# Altium schematic sheet CallerID.SchDoc: Caller ID
size A4; Organization: ORGANIZATION; Address1: ADDRESS 1; Address2: ADDRESS 2; Address3: ADDRESS 3; Address4: ADDRESS 4; Revision: -; SheetNumber: 7; SheetTotal: 11; ENG_APP_DATE: --/--/--; DSN_APP_DATE: --/--/--; CHK_APP_DATE: --/--/--
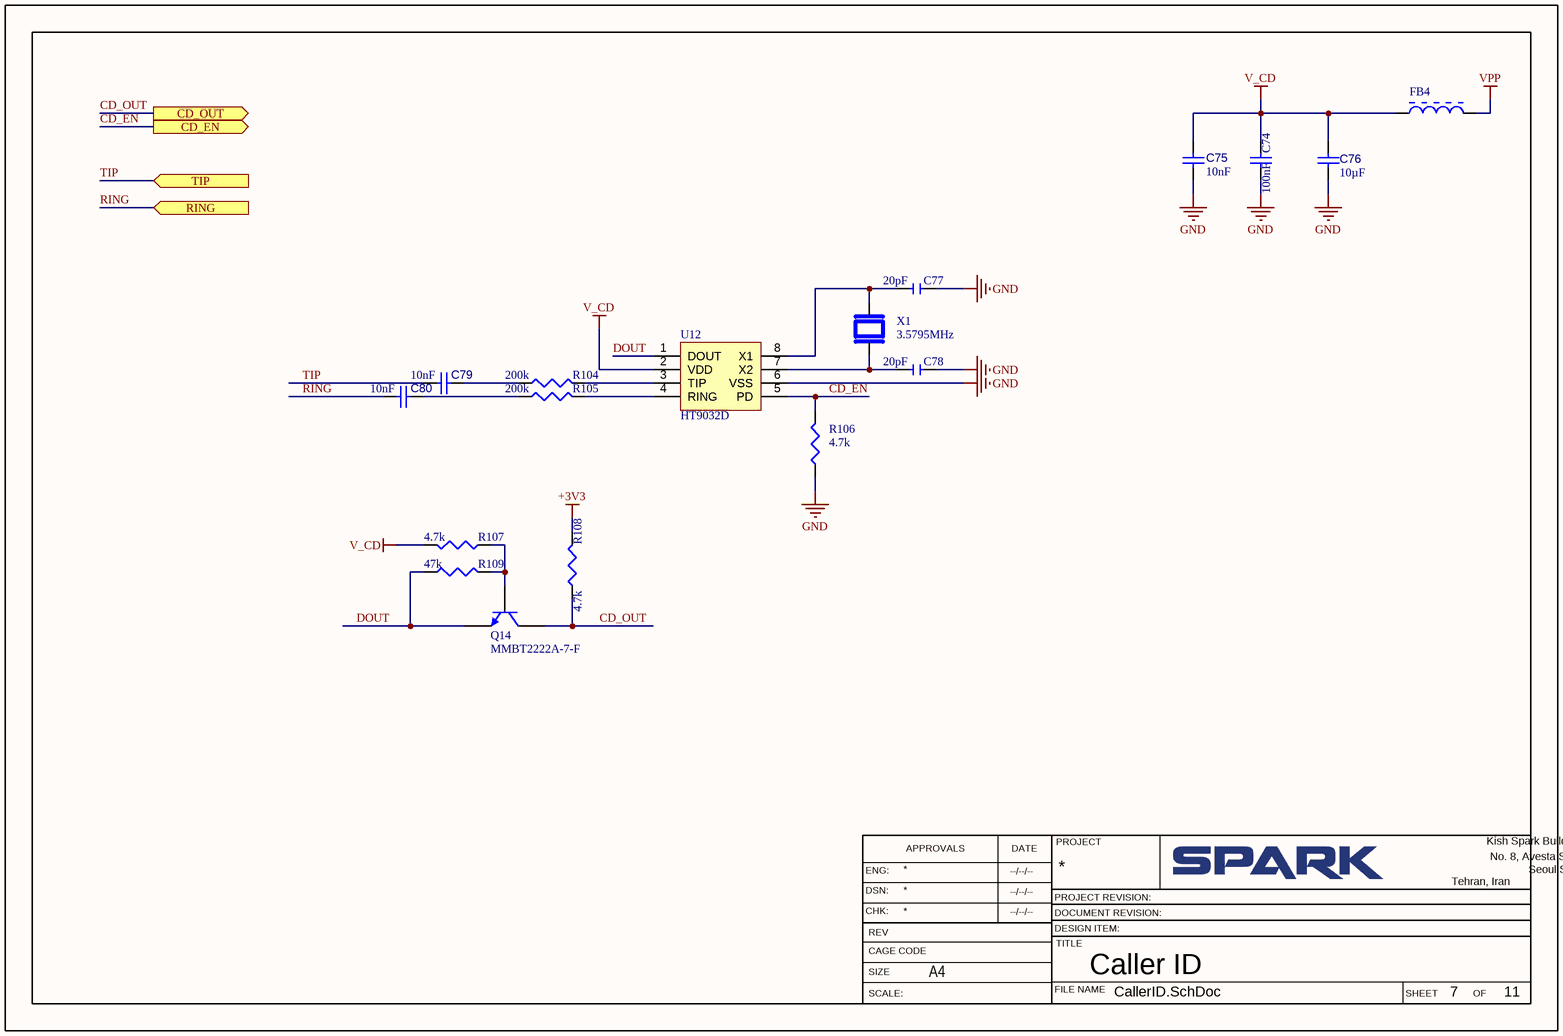
[diagram p0: CallerID.SchDoc]

## Parts
C74  value 100nF  [C0603]  (hidden comment: CC0603KRX7R8BB104)
C75  value 10nF  [C0603]  (hidden comment: 06035C103KAT2A)
C76  value 10µF  [0805]  (hidden comment: C0805C106K9PACTU)
C77  value 20pF  [0805]  (hidden comment: CMP-001-00183-1)
C78  value 20pF  [0805]  (hidden comment: CMP-001-00183-1)
C79  value 10nF  [C0603]  (hidden comment: 06035C103KAT2A)
C80  value 10nF  [C0603]  (hidden comment: 06035C103KAT2A)
FB4  CMP-006-00051-1  [R0603]  (value not drawn)
Q14  MMBT2222A-7-F  [SOT23127P600-8N]
R104  value 200k  [0805]  (hidden comment: CMP-009-00307-1)
R105  value 200k  [0805]  (hidden comment: CMP-009-00307-1)
R106  value 4.7k  [R0603]  (hidden comment: KTR03EZPJ472)
R107  value 4.7k  [R0603]  (hidden comment: KTR03EZPJ472)
R108  value 4.7k  [R0603]  (hidden comment: KTR03EZPJ472)
R109  value 47k  [0805]  (hidden comment: CMP-009-00314-1)
U12  HT9032D  [SSOIC8]
X1  Frequency: 3.5795MHz  [XTAL]  (hidden comment: CMP-003-00038-1)

## Ports
CD_EN (out), CD_OUT (out), RING (in), TIP (in)

## Nets
+3V3: R108.2
GND: C74.2 C75.2 C76.1 C77.1 C78.1 R106.1 U12.6(VSS)
V_CD: C74.1 C75.1 C76.2 FB4.1 R107.2 U12.2(VDD)
VPP: FB4.2
CD_EN: R106.2 U12.5(PD) ; port CD_EN
CD_OUT: Q14.3(C) R108.1 ; port CD_OUT
DOUT: Q14.1(E) R109.1 U12.1(DOUT)
RING: C80.2 ; port RING
TIP: C79.2 ; port TIP
NetC77_2: C77.2 U12.8(X1) X1.1
NetC78_2: C78.2 U12.7(X2) X1.2
NetC79_1: C79.1 R104.1
NetC80_1: C80.1 R105.1
NetQ14_2: Q14.2(B) R107.1 R109.2
NetR104_2: R104.2 U12.3(TIP)
NetR105_2: R105.2 U12.4(RING)

## Notes on the sheet
- APPROVALS
- DATE
- PROJECT
- Kish Spark Building
- No. 8, Avesta Street
- ENG:
- DSN:
- CHK:
- PROJECT REVISION:
- DESIGN ITEM:
- DOCUMENT REVISION:
- Tehran, Iran
- Seoul Street, Sheikh Bahaie
- SIZE
- REV
- SCALE:
- CAGE CODE
- A4
- FILE NAME
- TITLE
- SHEET
- OF

## Library data of the parts
C74 = CMP-001-00108-2: YAGEO - CC0603KRX7R8BB104 - CERAMIC CAPACITOR, 0.1UF, 25V, X7R, 10%, 0603, FULL REEL; Case/Package: 0603; Pins: 2; RoHS Compliant: Yes; Min Operating Temperature: -55°C; Max Operating Temperature: 125°C; Voltage Rating: 25V; Tolerance: 10%; Design Item ID: CC0603KRX7R8BB104; Case Code (Metric): 1608; Category: Ceramic Capacitors; Depth: 0.8mm; Dielectric: X7R; Halogen Free: Halogen Free; Height: 0.8mm; Lead Free: Lead Free; Length: 1.6mm; Manufacturer 1: Yageo; Manufacturer Part Number 1: CC0603KRX7R8BB104; Mount: Surface Mount; Package Quantity: 1; Packaging: Tape and Reel; Pricing 1: 1=0.10000, 10=0.05000, 50=0.02720, 100=0.02220, 500=0.01586, 1000=0.01246 (USD); Radiation Hardening: No; REACH SVHC: Unknown; Resistor Type: Ceramic; RoHS: Yes; Series: CC; Source: PTZLib.SchLib; Stock 1: 4053185; Termination: SMD/SMT; Thickness: 0.035inch; Voltage: 25V; Voltage Rating (DC): 25V; Width: 0.8mm; ComponentLink1Description: https://datasheet.ciiva.com/144/mlccorderingcode-144075.pdf?src-supplier=Digi-Key; ComponentLink1URL: https://datasheet.ciiva.com/144/mlccorderingcode-144075.pdf?src-supplier=Digi-Key; ComponentLink2Description: https://datasheet.ciiva.com/11786/0900766b80c10176-11786120.pdf?src-supplier=RSComponents; ComponentLink2URL: https://datasheet.ciiva.com/11786/0900766b80c10176-11786120.pdf?src-supplier=RSComponents; ComponentLink3Description: https://datasheet.ciiva.com/7978/1489800-7978155.pdf?src-supplier=Element14; ComponentLink3URL: https://datasheet.ciiva.com/7978/1489800-7978155.pdf?src-supplier=Element14; ComponentLink4Description: https://datasheet.ciiva.com/28450/1489800-28450584.pdf?src-supplier=Element14; ComponentLink4URL: https://datasheet.ciiva.com/28450/1489800-28450584.pdf?src-supplier=Element14; ComponentLink5Description: https://datasheet.ciiva.com/144/mlccorderingcode-144074.pdf?src-supplier=Digi-Key; ComponentLink5URL: https://datasheet.ciiva.com/144/mlccorderingcode-144074.pdf?src-supplier=Digi-Key; ComponentLink6Description: https://datasheet.ciiva.com/144/mlccorderingcode-144073.pdf?src-supplier=Digi-Key; ComponentLink6URL: https://datasheet.ciiva.com/144/mlccorderingcode-144073.pdf?src-supplier=Digi-Key; ComponentLink7Description: https://datasheet.ciiva.com/13389/upy-gphc-x7r-6-3v-to-50v-8-13389352.pdf?src-supplier=Mouser; ComponentLink7URL: https://datasheet.ciiva.com/13389/upy-gphc-x7r-6-3v-to-50v-8-13389352.pdf?src-supplier=Mouser; ComponentLink8Description: https://datasheet.ciiva.com/11587/upy-gphc-x7r-6-3v-to-50v-8-11587208.pdf?src-supplier=Avnet; ComponentLink8URL: https://datasheet.ciiva.com/11587/upy-gphc-x7r-6-3v-to-50v-8-11587208.pdf?src-supplier=Avnet; ComponentLink9Description: https://datasheet.ciiva.com/26829/getdatasheetpartid-403577-26829431.pdf?src-supplier=Verical; ComponentLink9URL: https://datasheet.ciiva.com/26829/getdatasheetpartid-403577-26829431.pdf?src-supplier=Verical; ComponentLink10Description: https://datasheet.ciiva.com/17434/upy-gphc-x7r-6-3v-to-50v-8-17434263.pdf?src-supplier=Avnet+Europe; ComponentLink10URL: https://datasheet.ciiva.com/17434/upy-gphc-x7r-6-3v-to-50v-8-17434263.pdf?src-supplier=Avnet+Europe
C75 C79 C80 = CMP-001-00096-2: 0603 10nF 50 V ±10 % Tolerance X7R Surface Mount Multilayer Ceramic Capacitor; Manufacturer: Kyocera AVX; Voltage Rating: 50V; Tolerance: 10%; Dissipation Factor: 2.5%; Insulation Resistance: 100GR; Case/Package: 0603; Pins: 2; Min Operating Temperature: -55°C; Max Operating Temperature: 125°C; Design Item ID: 06035C103KAT2A; Case Code (Metric): 1608; Category: Ceramic Capacitors; Contact Plating: Tin,Matte; Depth: 0.81mm; Dielectric: X7R; Dielectric Material: Ceramic; Height: 0.9mm; Lead Free: Lead Free; Length: 1.6mm; Manufacturer Part Number: 06035C103KAT2A; Mount: Surface Mount,PCB; Packaging: Tape and Reel; Radiation Hardening: No; REACH SVHC: No SVHC; RoHS: Yes; Stock 1: 4334081; Termination: SMD/SMT; Thickness: 0.035inch; Voltage: 50V; Voltage Rating (DC): 50V; Width: 0.032inch; ComponentLink1Description: https://datasheet.ciiva.com/2987/cx7r-2987824.pdf?src-supplier=Avnet; ComponentLink1URL: https://datasheet.ciiva.com/2987/cx7r-2987824.pdf?src-supplier=Avnet; ComponentLink2Description: https://datasheet.ciiva.com/1124/1679506-1124848.pdf?src-supplier=Element14; ComponentLink2URL: https://datasheet.ciiva.com/1124/1679506-1124848.pdf?src-supplier=Element14; ComponentLink3Description: https://datasheet.ciiva.com/7855/1679506-7855082.pdf?src-supplier=Element14; ComponentLink3URL: https://datasheet.ciiva.com/7855/1679506-7855082.pdf?src-supplier=Element14; ComponentLink4Description: https://datasheet.ciiva.com/150/cx7r-150227.pdf?src-supplier=Digi-Key; ComponentLink4URL: https://datasheet.ciiva.com/150/cx7r-150227.pdf?src-supplier=Digi-Key; ComponentLink5Description: https://datasheet.ciiva.com/150/cx7r-150229.pdf?src-supplier=Digi-Key; ComponentLink5URL: https://datasheet.ciiva.com/150/cx7r-150229.pdf?src-supplier=Digi-Key
C76 = CMP-001-00180-2: Ceramic Capacitor, 10UF, 6.3V, X5R, 10%, 0805, Full Reel; Manufacturer: KEMET; Dissipation Factor: 5%; Capacitor Type: Ceramic Capacitors; Manufacturer Part Number: C0805C106K9PACTU; Mount: Surface Mount; Case/Package: 0805; Case Code (Metric): 2012; Dielectric Material: Ceramic; Contact Material: Tin; Min Operating Temperature: -55°C; Max Operating Temperature: 85°C; Tolerance: 10%; Voltage Rating (DC): 6.3V; Dielectric: X5R; Packaging: Tape and Reel; Voltage Rating: 6.3V; Series: SMD Comm X5R; Construction: Flat; Length: 2mm; Width: 1.2mm; Height: 1.25mm; Depth: 1.25mm; Lead Pitch: 0.75mm; Radiation Hardening: No; RoHS Compliant: Yes; Lead Free: Lead Free; Reach SVHC Compliant: No; ComponentLink1URL: https://datasheet.ciiva.com/7842/kem-c1006-x5r-smd-7842200.pdf?src-supplier=Element14; ComponentLink1Description: https://datasheet.ciiva.com/7842/kem-c1006-x5r-smd-7842200.pdf?src-supplier=Element14; ComponentLink2URL: https://datasheet.ciiva.com/7842/kem-c1006-x5r-smd-7842201.pdf?src-supplier=Element14; ComponentLink2Description: https://datasheet.ciiva.com/7842/kem-c1006-x5r-smd-7842201.pdf?src-supplier=Element14; ComponentLink3URL: https://datasheet.ciiva.com/7842/40889-7842553.pdf?src-supplier=Element14; ComponentLink3Description: https://datasheet.ciiva.com/7842/40889-7842553.pdf?src-supplier=Element14; ComponentLink4URL: https://datasheet.ciiva.com/7842/40889-7842554.pdf?src-supplier=Element14; ComponentLink4Description: https://datasheet.ciiva.com/7842/40889-7842554.pdf?src-supplier=Element14; ComponentLink5URL: https://datasheet.ciiva.com/18193/getdatasheetpartid-320652-18193500.pdf?src-supplier=Verical; ComponentLink5Description: https://datasheet.ciiva.com/18193/getdatasheetpartid-320652-18193500.pdf?src-supplier=Verical; Pins: 2; Mounting Technology: SMD/SMT
C77 C78 = CMP-001-00183-1: CAP CER 20PF 50V NPO 0805; Manufacturer: Yageo; Tolerance: 5%; Dielectric: NP0; Manufacturer Part Number: CC0805JRNPO9BN200; RoHS: Yes; Category: Ceramic Capacitors; Stock: 3029; Pricing: 1=0.13, 10=0.054, 50=0.054, 100=0.032, 1000=0.026, 10000=0.017 (USD); Mounting Technology: Surface Mount; Case/Package: 0805; Pins: 2; Case Code (Metric): 2012; Min Operating Temperature: -55°C; Max Operating Temperature: 125°C; Voltage Rating: 50V; Packaging: Tape and Reel; Voltage Rating (DC): 50V; Termination: SMD/SMT; Series: CC; Length: 0.079inch; Width: 1.25mm; Thickness: 0.028inch; Lead Free: Lead Free; ComponentLink1URL: https://datasheet.ciiva.com/5427/upy-gp-np0-16v-to-50v-8-5427416.pdf?src-supplier=Mouser; ComponentLink1Description: https://datasheet.ciiva.com/5427/upy-gp-np0-16v-to-50v-8-5427416.pdf?src-supplier=Mouser; Design Item ID: CC0805JRNPO9BN200; Component Type: Standard; Pin Count: 2; Source: V4-TEL.SCHLIB
FB4 = CMP-006-00051-1: Ferrite Beads 0603 60ohm; Manufacturer 1: Murata; Manufacturer Part Number 1: BLM18PG471SN1B; Tolerance: 25%; Impedance: 470R; DC Resistance (DCR): 200mR; Current Rating: 1A; RoHS: Yes; Category: Ferrite Beads and Chips; Case/Package: 0603; Min Operating Temperature: -55°C; Max Operating Temperature: 125°C; Package Quantity: 1000; Packaging: Bulk; ComponentLink1URL: http://www.mouser.com/ds/2/281/c31e-794748.pdf?src-supplier=Mouser; ComponentLink1Description: http://www.mouser.com/ds/2/281/c31e-794748.pdf?src-supplier=Mouser; Pins: 2; Design Item ID: BLM18PG471SN1B; Source: PTZLib.SchLib
Q14 = CMP-012-00003-2: MMBT2222 Series NPN 350 mW 40 V 600 mA SMT Small Signal Transistor - SOT-23; Manufacturer: Diodes; Current Rating: 600mA; Voltage Rating: 40V; Collector Base Voltage (VCBO): 75V; Collector Emitter Saturation Voltage: 1V; Current: 1A; Element Configuration: Single; Emitter Base Voltage (VEBO): 6V; Frequency: 300MHz; hFE Min: 100; Max Power Dissipation: 300mW; Number of Elements: 1; Power Dissipation: 350mW; Case/Package: SOT-23-3; Pins: 3; RoHS Compliant: Yes; Min Operating Temperature: -55°C; Max Operating Temperature: 150°C; Design Item ID: MMBT2222A-7-F; Category: BJTs; Collector Emitter Breakdown Voltage: 40V; Collector Emitter Voltage (VCEO): 40V; Collector-emitter Voltage-Max: 1V; Component Type: Standard; Contact Plating: Tin,Matte; Continuous Collector Current: 600mA; Gain Bandwidth Product: 300MHz; Height: 1mm; Lead Free: Lead Free; Length: 3.05mm; Manufacturer Part Number: MMBT2222A-7-F; Max Collector Current: 600mA; Max Frequency: 300MHz; Mount: Surface Mount; Package Quantity: 3000; Packaging: Tape and Reel; Pin Count: 3; Polarity: NPN; Pricing 1: 1=0.14000, 10=0.13300, 50=0.13300, 100=0.07200, 500=0.04500, 1000=0.03100, 3000=0.02300, 9000=0.02000, 10000=0.02000, 24000=0.01800, 45000=0.01500 (USD); Radiation Hardening: No; Reach SVHC Compliant: Yes; RoHS: Yes; Series: Automotive, AEC-Q101; Source: PTZ.SCHLIB; Stock 1: 1743698; Termination: SMD/SMT; Transition Frequency: 300MHz; Voltage: 40V; Voltage Rating (DC): 40V; Weight: 0.000282oz; Width: 1.4mm; ComponentLink1Description: https://datasheet.ciiva.com/15139/getdatasheetpartid-82692-15139078.pdf?src-supplier=Verical; ComponentLink1URL: https://datasheet.ciiva.com/15139/getdatasheetpartid-82692-15139078.pdf?src-supplier=Verical; ComponentLink2Description: https://datasheet.ciiva.com/8029/ds30041-8029709.pdf?src-supplier=Element14; ComponentLink2URL: https://datasheet.ciiva.com/8029/ds30041-8029709.pdf?src-supplier=Element14; ComponentLink3Description: https://datasheet.ciiva.com/11201/ds30041-11201864.pdf?src-supplier=Avnet; ComponentLink3URL: https://datasheet.ciiva.com/11201/ds30041-11201864.pdf?src-supplier=Avnet; ComponentLink4Description: https://datasheet.ciiva.com/16199/ds30041-16199045.pdf?src-supplier=Future+Electronics; ComponentLink4URL: https://datasheet.ciiva.com/16199/ds30041-16199045.pdf?src-supplier=Future+Electronics; ComponentLink5Description: https://datasheet.ciiva.com/11198/ds30041-11198965.pdf?src-supplier=Avnet; ComponentLink5URL: https://datasheet.ciiva.com/11198/ds30041-11198965.pdf?src-supplier=Avnet; ComponentLink6Description: https://datasheet.ciiva.com/972/ds30041-972551.pdf?src-supplier=Digi-Key; ComponentLink6URL: https://datasheet.ciiva.com/972/ds30041-972551.pdf?src-supplier=Digi-Key; ComponentLink7Description: https://datasheet.ciiva.com/972/ds30041-972552.pdf?src-supplier=Digi-Key; ComponentLink7URL: https://datasheet.ciiva.com/972/ds30041-972552.pdf?src-supplier=Digi-Key; ComponentLink8Description: https://datasheet.ciiva.com/972/ds30041-972550.pdf?src-supplier=Digi-Key; ComponentLink8URL: https://datasheet.ciiva.com/972/ds30041-972550.pdf?src-supplier=Digi-Key
R104 R105 = CMP-009-00307-1: Res Thick Film 0805 200K Ohm 1% 1/8W ±100ppm/°C Molded SMD Paper T/R; Manufacturer: Yageo; Manufacturer Part Number: RC0805FR-07200KL; Power Rating: 125mW; Voltage Rating: 150V; RoHS: Yes; Category: Chip SMD Resistors; Stock 1: 312674; Pricing 1: 1=0.1, 10=0.033, 50=0.033, 100=0.014, 1000=0.006, 10000=0.003 (USD); Case/Package: 0805; Case Code (Metric): 2012; Contact Plating: Tin,Matte; Min Operating Temperature: -55°C; Max Operating Temperature: 155°C; Tolerance: 1%; Packaging: Tape and Reel; Termination: SMD/SMT; Resistor Type: Thick Film; Temperature Coefficient: 100ppm/°C; Voltage Rating (DC): 150V; Working Voltage: 150V; Number of Terminations: 2; Features: Moisture Resistant; Series: RC; Max Power Dissipation: 125mW; Resistance Tolerance: 1%; Technology: THICK FILM; Construction: Rectangular; Length: 2mm; Height: 0.5mm; Depth: 1.25mm; Reach SVHC Compliant: No; Military Standard: Not; Lead Free: Lead Free; RoHS Compliant: Yes; ComponentLink1URL: https://datasheet.ciiva.com/46395/444164-46395126.pdf?src-supplier=Element14; ComponentLink1Description: https://datasheet.ciiva.com/46395/444164-46395126.pdf?src-supplier=Element14; ComponentLink2URL: https://datasheet.ciiva.com/12668/rc0805-12668200.pdf?src-supplier=Mouser; ComponentLink2Description: https://datasheet.ciiva.com/12668/rc0805-12668200.pdf?src-supplier=Mouser; ComponentLink3URL: https://datasheet.ciiva.com/15189/getdatasheetpartid-71710-15189925.pdf?src-supplier=Verical; ComponentLink3Description: https://datasheet.ciiva.com/15189/getdatasheetpartid-71710-15189925.pdf?src-supplier=Verical; Pins: 2; Design Item ID: RC0805FR-07200KL; Component Type: Standard; Pin Count: 2; Source: V4-TEL.SCHLIB
R106-R108 = CMP-009-00190-2: RES SMD 4.7K OHM 5% 1/10W 0603; Manufacturer 1: Rohm; Max Power Dissipation: 100mW; Temperature Coefficient: 200ppm/°C; Case/Package: 0603; RoHS Compliant: Yes; Min Operating Temperature: -55°C; Max Operating Temperature: 155°C; Tolerance: 5%; Design Item ID: KTR03EZPJ472; Category: Chip SMD Resistors; Height: 0.022inch; Length: 0.063inch; Manufacturer Part Number 1: KTR03EZPJ472; Number of Terminations: 2; Package Quantity: 5000; Packaging: Tape and Reel; Pricing 1: 1=0.13000, 10=0.11500, 50=0.11500, 100=0.04400, 1000=0.02200, 10000=0.01400 (USD); Resistor Type: Thick Film; RoHS: Yes; Series: KTR03; Source: PTZLib.SchLib; Stock 1: 12843; Width: 0.031inch; ComponentLink1Description: https://datasheet.ciiva.com/14984/ktr-14984741.pdf?src-supplier=Digi-Key; ComponentLink1URL: https://datasheet.ciiva.com/14984/ktr-14984741.pdf?src-supplier=Digi-Key
R109 = CMP-009-00314-1: High Precision-High Stability Chip Resistor Thin Film 0805 47kOhm 1% Paper T/R; Manufacturer: Yageo; Manufacturer Part Number: RT0805FRE0747KL; Power Rating: 125mW; Voltage Rating: 150V; Temperature Coefficient: 50ppm/°C; RoHS: Yes; Category: Chip SMD Resistors; Stock 1: 83330; Pricing 1: 1=0.1, 10=0.081, 50=0.081, 100=0.031, 1000=0.014, 10000=0.009 (USD); Case/Package: 0805; Case Code (Metric): 2012; Min Operating Temperature: -55°C; Max Operating Temperature: 125°C; Tolerance: 1%; Packaging: Tape and Reel; Resistor Type: Thin Film; Termination: SMD/SMT; Number of Terminations: 2; Max Power Dissipation: 125mW; Voltage Rating (DC): 150V; Features: Moisture Resistant; Series: RT; Resistance Tolerance: 1%; Length: 0.079inch; Width: 0.049inch; Height: 0.024inch; Reach SVHC Compliant: No; Lead Free: Lead Free; RoHS Compliant: Yes; ComponentLink1URL: https://datasheet.ciiva.com/7942/1392914-7942152.pdf?src-supplier=Element14; ComponentLink1Description: https://datasheet.ciiva.com/7942/1392914-7942152.pdf?src-supplier=Element14; ComponentLink2URL: https://datasheet.ciiva.com/7942/1392914-7942153.pdf?src-supplier=Element14; ComponentLink2Description: https://datasheet.ciiva.com/7942/1392914-7942153.pdf?src-supplier=Element14; ComponentLink3URL: https://datasheet.ciiva.com/5990/1392914-5990606.pdf?src-supplier=Farnell; ComponentLink3Description: https://datasheet.ciiva.com/5990/1392914-5990606.pdf?src-supplier=Farnell; Pins: 2; Design Item ID: RT0805FRE0747KL; Component Type: Standard; Pin Count: 2; Source: V4-TEL.SCHLIB
U12 = CMP-076-000005-3: SOP-8 Telecommunication Interface ICs ROHS; Component Type: Standard; RoHS Compliant: No; Mounting Technology: SMT; Pins: 8
X1 = CMP-003-00038-1: Crystal 3.579545MHz ±30ppm (Tol) ±50ppm (Stability) 18pF FUND 180Ohm 2-Pin HC-49/US SMD T/R; Manufacturer: Abracon; ESR (Equivalent Series Resistance): 180; Manufacturer Part Number: ABLS-3.579545MHZ-B4-T; RoHS: Yes; Category: Crystals; Stock: 4835; Pricing: 1=0.17, 10=0.138, 50=0.138, 100=0.138, 1000=0.132, 10000=0.108 (USD); Mounting Technology: Surface Mount; Case/Package: SMD/SMT; Min Operating Temperature: -20°C; Max Operating Temperature: 70°C; Packaging: Tape and Reel; Frequency Tolerance: 30ppm; Load Capacitance: 18pF; Package Quantity: 1000; Tolerance: 30ppm; Frequency Stability: 50ppm; Termination: SMD/SMT; ESR: 180; Series: ABLS; Length: 11.4mm; Width: 4.7mm; Height: 4.2mm; Depth: 4.7mm; Radiation Hardening: No; Lead Free: Lead Free; ComponentLink1URL: https://datasheet.ciiva.com/15116/getdatasheetpartid-719920-15116797.pdf?src-supplier=Verical; ComponentLink1Description: https://datasheet.ciiva.com/15116/getdatasheetpartid-719920-15116797.pdf?src-supplier=Verical; ComponentLink2URL: https://datasheet.ciiva.com/854/abls-854168.pdf?src-supplier=Digi-Key; ComponentLink2Description: https://datasheet.ciiva.com/854/abls-854168.pdf?src-supplier=Digi-Key; ComponentLink3URL: https://datasheet.ciiva.com/854/abls-854169.pdf?src-supplier=Digi-Key; ComponentLink3Description: https://datasheet.ciiva.com/854/abls-854169.pdf?src-supplier=Digi-Key; ComponentLink4URL: https://datasheet.ciiva.com/854/abls-854170.pdf?src-supplier=Digi-Key; ComponentLink4Description: https://datasheet.ciiva.com/854/abls-854170.pdf?src-supplier=Digi-Key; ComponentLink5URL: https://datasheet.ciiva.com/4944/abls-44621-4944684.pdf?src-supplier=Mouser; ComponentLink5Description: https://datasheet.ciiva.com/4944/abls-44621-4944684.pdf?src-supplier=Mouser; Pins: 2; Design Item ID: ABLS-3.579545MHZ-B4-T; Component Type: Standard; Source: V4-TEL.SCHLIB